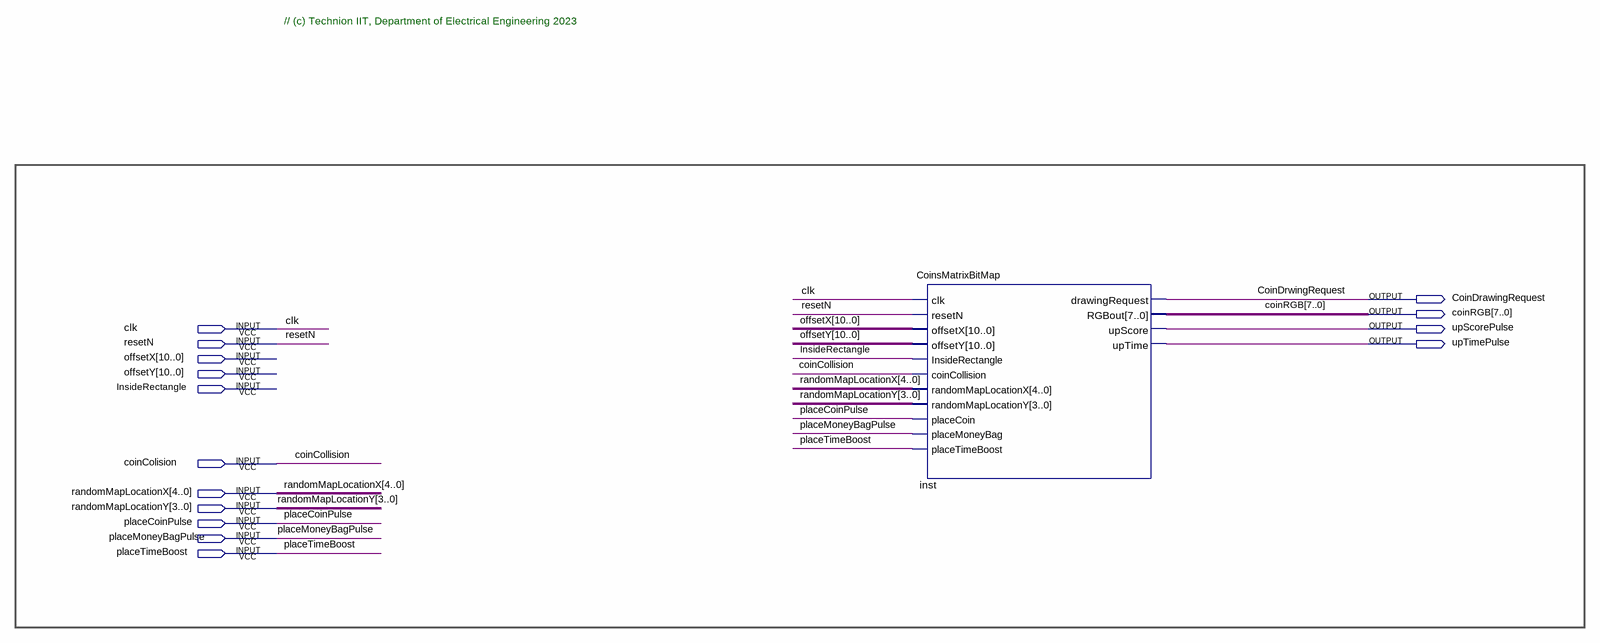
[diagram p0: schematic sheet]
// Quartus schematic COINS_DISPLAY.bdf as structural Verilog: 1 symbols, 15 pins
module COINS_DISPLAY (
  input  clk,
  input  resetN,
  input  [10:0] offsetX,
  input  [10:0] offsetY,
  input  InsideRectangle,
  input  coinColision,
  input  [4:0] randomMapLocationX,
  input  [3:0] randomMapLocationY,
  input  placeCoinPulse,
  input  placeMoneyBagPulse,
  input  placeTimeBoost,
  output CoinDrawingRequest,
  output [7:0] coinRGB,
  output upScorePulse,
  output upTimePulse
);

  CoinsMatrixBitMap inst (
    .clk(clk), .resetN(resetN), .offsetX(offsetX), .offsetY(offsetY), .InsideRectangle(InsideRectangle),
    .coinCollision(coinColision), .randomMapLocationX(randomMapLocationX),
    .randomMapLocationY(randomMapLocationY), .placeCoin(placeCoinPulse), .placeMoneyBag(placeMoneyBagPulse),
    .placeTimeBoost(placeTimeBoost), .drawingRequest(CoinDrawingRequest), .RGBout(coinRGB),
    .upScore(upScorePulse), .upTime(upTimePulse));

  // Other names for the same wires on the sheet: coinCollision = coinColision; CoinDrwingRequest = CoinDrawingRequest

  // Notes on the sheet:
  //   // (c) Technion IIT, Department of Electrical Engineering 2023
endmodule
